# Altium project UZ_A_MAX11331.PrjPCB (part 3 of 3)
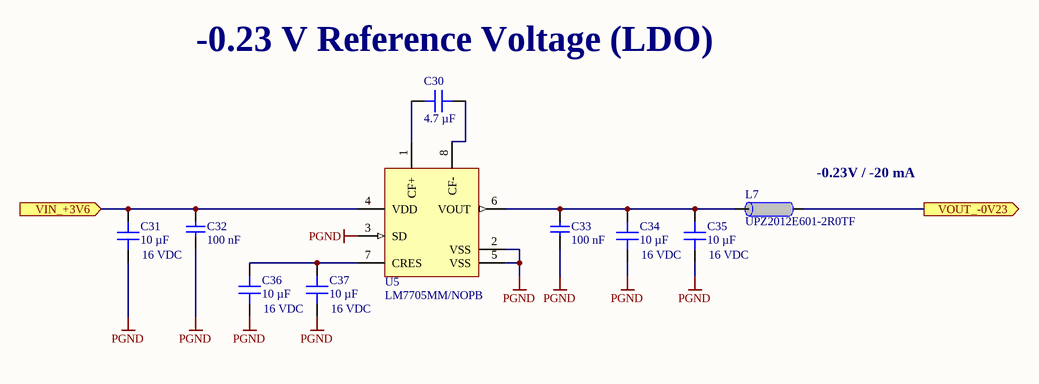
[diagram p12: Power_Supply_3.SchDoc]

## Nets that join several sheets
1V65_REF: AF1 (8 pins), AF2 (8 pins), AF3 (8 pins), AF4 (8 pins), AF5 (8 pins), AF6 (8 pins), Power_Supply_2 (C40.2 C41.2 TP11.1 U6.1)
3V3_REF: U_ADC_Signal_Distribution/ADC1 (C5A.2 C6A.2 U1A.18), U_ADC_Signal_Distribution/ADC2 (C5B.2 C6B.2 U1B.18), U_ADC_Signal_Distribution/ADC3 (C5C.2 C6C.2 U1C.18), Power_Supply_2 (C42.2 C43.2 TP10.1 U6.5)
+1V8: TopSheet (R3.2), Power_Supply_1 (C45.2 U7.2 U7.4), U_ADC_Signal_Distribution/ADC1 (C3A.2 C4A.2 U1A.26), U_ADC_Signal_Distribution/ADC2 (C3B.2 C4B.2 U1B.26), U_ADC_Signal_Distribution/ADC3 (C3C.2 C4C.2 U1C.26)
+3V6: TopSheet (R2.2), Power_Supply_1 (8 pins), Power_Supply_2 (L8.2), U_Power_Supply_2/Vneg_1 (C31A.2 C32A.2 U5A.4), U_Power_Supply_2/Vneg_2 (C31B.2 C32B.2 U5B.4), U_Power_Supply_2/Vneg_3 (C31C.2 C32C.2 U5C.4)
+3V6_A: AF1 (8 pins), U_ADC_Signal_Distribution/ADC1 (C1A.2 C2A.2 U1A.20 U1A.21), U_ADC_Signal_Distribution/ADC2 (C1B.2 C2B.2 U1B.20 U1B.21), U_ADC_Signal_Distribution/ADC3 (C1C.2 C2C.2 U1C.20 U1C.21), AF2 (8 pins), AF3 (8 pins), AF4 (8 pins), AF5 (8 pins), AF6 (8 pins), Power_Supply_2 (C74.2 C81.2 L5.1 TP9.1)
+5V2: AF1/BOA1 (C51A.1 R41A.2 R54A.2 U3A.8), AF1/BOA2 (C51B.1 R41B.2 R54B.2 U3B.8), AF1/BOA3 (C51C.1 R41C.2 R54C.2 U3C.8), AF1/BOA4 (C51D.1 R41D.2 R54D.2 U3D.8), AF2/BOA1 (C51E.1 R41E.2 R54E.2 U3E.8), AF2/BOA2 (C51F.1 R41F.2 R54F.2 U3F.8), AF2/BOA3 (C51G.1 R41G.2 R54G.2 U3G.8), AF2/BOA4 (C51H.1 R41H.2 R54H.2 U3H.8), AF3/BOA1 (C51I.1 R41I.2 R54I.2 U3I.8), AF3/BOA2 (C51J.1 R41J.2 R54J.2 U3J.8), AF3/BOA3 (C51K.1 R41K.2 R54K.2 U3K.8), AF3/BOA4 (C51L.1 R41L.2 R54L.2 U3L.8), AF4/BOA1 (C51M.1 R41M.2 R54M.2 U3M.8), AF4/BOA2 (C51N.1 R41N.2 R54N.2 U3N.8), AF4/BOA3 (C51O.1 R41O.2 R54O.2 U3O.8), AF4/BOA4 (C51P.1 R41P.2 R54P.2 U3P.8), AF5/BOA1 (C51Q.1 R41Q.2 R54Q.2 U3Q.8), AF5/BOA2 (C51R.1 R41R.2 R54R.2 U3R.8), AF5/BOA3 (C51S.1 R41S.2 R54S.2 U3S.8), AF5/BOA4 (C51T.1 R41T.2 R54T.2 U3T.8), AF6/BOA1 (C51U.1 R41U.2 R54U.2 U3U.8), AF6/BOA2 (C51V.1 R41V.2 R54V.2 U3V.8), AF6/BOA3 (C51W.1 R41W.2 R54W.2 U3W.8), AF6/BOA4 (C51X.1 R41X.2 R54X.2 U3X.8), Power_Supply_2 (C79.2 C80.2 L12.1 TP8.1)
+6V5: Power_Supply_1 (7 pins), Power_Supply_2 (L2.2 L11.2)
AGND: AnalogConnector (X5.1 X5.2 X5.3 X5.4), AF1 (12 pins), AF1/BOA1 (7 pins), AF1/BOA2 (7 pins), AF1/BOA3 (7 pins), AF1/BOA4 (7 pins), AF1/CDMF1 (C8A.1 C11A.2), AF1/CDMF2 (C8B.1 C11B.2), AF1/CDMF3 (C8C.1 C11C.2), AF1/CDMF4 (C8D.1 C11D.2), Power_Supply_1 (L6.1), U_ADC_Signal_Distribution/ADC1 (7 pins), U_ADC_Signal_Distribution/ADC2 (7 pins), U_ADC_Signal_Distribution/ADC3 (7 pins), AF2 (12 pins), AF2/BOA1 (7 pins), AF2/BOA2 (7 pins), AF2/BOA3 (7 pins), AF2/BOA4 (7 pins), AF2/CDMF1 (C8E.1 C11E.2), AF2/CDMF2 (C8F.1 C11F.2), AF2/CDMF3 (C8G.1 C11G.2), AF2/CDMF4 (C8H.1 C11H.2), AF3 (12 pins), AF3/BOA1 (7 pins), AF3/BOA2 (7 pins), AF3/BOA3 (7 pins), AF3/BOA4 (7 pins), AF3/CDMF1 (C8I.1 C11I.2), AF3/CDMF2 (C8J.1 C11J.2), AF3/CDMF3 (C8K.1 C11K.2), AF3/CDMF4 (C8L.1 C11L.2), AF4 (12 pins), AF4/BOA1 (7 pins), AF4/BOA2 (7 pins), AF4/BOA3 (7 pins), AF4/BOA4 (7 pins), AF4/CDMF1 (C8M.1 C11M.2), AF4/CDMF2 (C8N.1 C11N.2), AF4/CDMF3 (C8O.1 C11O.2), AF4/CDMF4 (C8P.1 C11P.2), AF5 (12 pins), AF5/BOA1 (7 pins), AF5/BOA2 (7 pins), AF5/BOA3 (7 pins), AF5/BOA4 (7 pins), AF5/CDMF1 (C8Q.1 C11Q.2), AF5/CDMF2 (C8R.1 C11R.2), AF5/CDMF3 (C8S.1 C11S.2), AF5/CDMF4 (C8T.1 C11T.2), AF6 (12 pins), AF6/BOA1 (7 pins), AF6/BOA2 (7 pins), AF6/BOA3 (7 pins), AF6/BOA4 (7 pins), AF6/CDMF1 (C8U.1 C11U.2), AF6/CDMF2 (C8V.1 C11V.2), AF6/CDMF3 (C8W.1 C11W.2), AF6/CDMF4 (C8X.1 C11X.2), Power_Supply_2 (25 pins)
GND: TopSheet (D1.1), CarrierConnector (41 pins), AnalogConnector (C46.2 R26.2), Power_Supply_1 (L3.1 L9.1 X4.2), U_ADC_Signal_Distribution/ADC1 (C3A.1 C4A.1 U1A.25), U_ADC_Signal_Distribution/ADC2 (C3B.1 C4B.1 U1B.25), U_ADC_Signal_Distribution/ADC3 (C3C.1 C4C.1 U1C.25)
PGND: TopSheet (D2.1 D3.1), Power_Supply_1 (30 pins), U_Power_Supply_2/Vneg_1 (10 pins), U_Power_Supply_2/Vneg_2 (10 pins), U_Power_Supply_2/Vneg_3 (10 pins)
VIN: TopSheet (R1.2), CarrierConnector (F1.2), Power_Supply_1 (L3.4 X4.1)
Vneg_1: AF1 (14 pins), AF1/BOA1 (C52A.2 U3A.4), AF1/BOA2 (C52B.2 U3B.4), AF1/BOA3 (C52C.2 U3C.4), AF1/BOA4 (C52D.2 U3D.4), AF2 (14 pins), AF2/BOA1 (C52E.2 U3E.4), AF2/BOA2 (C52F.2 U3F.4), AF2/BOA3 (C52G.2 U3G.4), AF2/BOA4 (C52H.2 U3H.4), U_Power_Supply_2/Vneg_1 (L7A.1)
Vneg_2: AF3 (14 pins), AF3/BOA1 (C52I.2 U3I.4), AF3/BOA2 (C52J.2 U3J.4), AF3/BOA3 (C52K.2 U3K.4), AF3/BOA4 (C52L.2 U3L.4), AF4 (14 pins), AF4/BOA1 (C52M.2 U3M.4), AF4/BOA2 (C52N.2 U3N.4), AF4/BOA3 (C52O.2 U3O.4), AF4/BOA4 (C52P.2 U3P.4), U_Power_Supply_2/Vneg_2 (L7B.1)
Vneg_3: AF5 (14 pins), AF5/BOA1 (C52Q.2 U3Q.4), AF5/BOA2 (C52R.2 U3R.4), AF5/BOA3 (C52S.2 U3S.4), AF5/BOA4 (C52T.2 U3T.4), AF6 (14 pins), AF6/BOA1 (C52U.2 U3U.4), AF6/BOA2 (C52V.2 U3V.4), AF6/BOA3 (C52W.2 U3W.4), AF6/BOA4 (C52X.2 U3X.4), U_Power_Supply_2/Vneg_3 (L7C.1)
ADC_CS1: CarrierConnector (X1.29), U_ADC_Signal_Distribution/ADC1 (R29A.2)
ADC_CS2: CarrierConnector (X1.23), U_ADC_Signal_Distribution/ADC2 (R29B.2)
ADC_CS3: CarrierConnector (X1.17), U_ADC_Signal_Distribution/ADC3 (R29C.2)
ADC_MISO1: CarrierConnector (X1.31), U_ADC_Signal_Distribution/ADC1 (R27A.2)
ADC_MISO2: CarrierConnector (X1.25), U_ADC_Signal_Distribution/ADC2 (R27B.2)
ADC_MISO3: CarrierConnector (X1.19), U_ADC_Signal_Distribution/ADC3 (R27C.2)
ADC_MOSI1: CarrierConnector (X1.32), U_ADC_Signal_Distribution/ADC1 (R28A.2)
ADC_MOSI2: CarrierConnector (X1.26), U_ADC_Signal_Distribution/ADC2 (R28B.2)
ADC_MOSI3: CarrierConnector (X1.20), U_ADC_Signal_Distribution/ADC3 (R28C.2)
ADC_SCLK1: CarrierConnector (X1.30), U_ADC_Signal_Distribution/ADC1 (R30A.2)
ADC_SCLK2: CarrierConnector (X1.24), U_ADC_Signal_Distribution/ADC2 (R30B.2)
ADC_SCLK3: CarrierConnector (X1.18), U_ADC_Signal_Distribution/ADC3 (R30C.2)
AIN_ADC_N1: AF1/CDMF1 (C8A.2 C10A.1 R16A.2 TP4A.1), U_ADC_Signal_Distribution/ADC1 (U1A.30)
AIN_ADC_N2: AF1/CDMF2 (C8B.2 C10B.1 R16B.2 TP4B.1), U_ADC_Signal_Distribution/ADC1 (U1A.32)
AIN_ADC_N3: AF1/CDMF3 (C8C.2 C10C.1 R16C.2 TP4C.1), U_ADC_Signal_Distribution/ADC1 (U1A.2)
AIN_ADC_N4: AF1/CDMF4 (C8D.2 C10D.1 R16D.2 TP4D.1), U_ADC_Signal_Distribution/ADC1 (U1A.4)
AIN_ADC_N5: U_ADC_Signal_Distribution/ADC1 (U1A.6), AF2/CDMF1 (C8E.2 C10E.1 R16E.2 TP4E.1)
AIN_ADC_N6: U_ADC_Signal_Distribution/ADC1 (U1A.8), AF2/CDMF2 (C8F.2 C10F.1 R16F.2 TP4F.1)
AIN_ADC_N7: U_ADC_Signal_Distribution/ADC1 (U1A.10), AF2/CDMF3 (C8G.2 C10G.1 R16G.2 TP4G.1)
AIN_ADC_N8: U_ADC_Signal_Distribution/ADC1 (U1A.16), AF2/CDMF4 (C8H.2 C10H.1 R16H.2 TP4H.1)
AIN_ADC_N9: U_ADC_Signal_Distribution/ADC2 (U1B.30), AF3/CDMF1 (C8I.2 C10I.1 R16I.2 TP4I.1)
AIN_ADC_N10: U_ADC_Signal_Distribution/ADC2 (U1B.32), AF3/CDMF2 (C8J.2 C10J.1 R16J.2 TP4J.1)
AIN_ADC_N11: U_ADC_Signal_Distribution/ADC2 (U1B.2), AF3/CDMF3 (C8K.2 C10K.1 R16K.2 TP4K.1)
AIN_ADC_N12: U_ADC_Signal_Distribution/ADC2 (U1B.4), AF3/CDMF4 (C8L.2 C10L.1 R16L.2 TP4L.1)
AIN_ADC_N13: U_ADC_Signal_Distribution/ADC2 (U1B.6), AF4/CDMF1 (C8M.2 C10M.1 R16M.2 TP4M.1)
AIN_ADC_N14: U_ADC_Signal_Distribution/ADC2 (U1B.8), AF4/CDMF2 (C8N.2 C10N.1 R16N.2 TP4N.1)
AIN_ADC_N15: U_ADC_Signal_Distribution/ADC2 (U1B.10), AF4/CDMF3 (C8O.2 C10O.1 R16O.2 TP4O.1)
AIN_ADC_N16: U_ADC_Signal_Distribution/ADC2 (U1B.16), AF4/CDMF4 (C8P.2 C10P.1 R16P.2 TP4P.1)
AIN_ADC_N17: U_ADC_Signal_Distribution/ADC3 (U1C.30), AF5/CDMF1 (C8Q.2 C10Q.1 R16Q.2 TP4Q.1)
AIN_ADC_N18: U_ADC_Signal_Distribution/ADC3 (U1C.32), AF5/CDMF2 (C8R.2 C10R.1 R16R.2 TP4R.1)
AIN_ADC_N19: U_ADC_Signal_Distribution/ADC3 (U1C.2), AF5/CDMF3 (C8S.2 C10S.1 R16S.2 TP4S.1)
AIN_ADC_N20: U_ADC_Signal_Distribution/ADC3 (U1C.4), AF5/CDMF4 (C8T.2 C10T.1 R16T.2 TP4T.1)
AIN_ADC_N21: U_ADC_Signal_Distribution/ADC3 (U1C.6), AF6/CDMF1 (C8U.2 C10U.1 R16U.2 TP4U.1)
AIN_ADC_N22: U_ADC_Signal_Distribution/ADC3 (U1C.8), AF6/CDMF2 (C8V.2 C10V.1 R16V.2 TP4V.1)
AIN_ADC_N23: U_ADC_Signal_Distribution/ADC3 (U1C.10), AF6/CDMF3 (C8W.2 C10W.1 R16W.2 TP4W.1)
AIN_ADC_N24: U_ADC_Signal_Distribution/ADC3 (U1C.16), AF6/CDMF4 (C8X.2 C10X.1 R16X.2 TP4X.1)
AIN_ADC_P1: AF1/CDMF1 (C10A.2 C11A.1 R18A.2 TP5A.1), U_ADC_Signal_Distribution/ADC1 (U1A.29)
AIN_ADC_P2: AF1/CDMF2 (C10B.2 C11B.1 R18B.2 TP5B.1), U_ADC_Signal_Distribution/ADC1 (U1A.31)
AIN_ADC_P3: AF1/CDMF3 (C10C.2 C11C.1 R18C.2 TP5C.1), U_ADC_Signal_Distribution/ADC1 (U1A.1)
AIN_ADC_P4: AF1/CDMF4 (C10D.2 C11D.1 R18D.2 TP5D.1), U_ADC_Signal_Distribution/ADC1 (U1A.3)
AIN_ADC_P5: U_ADC_Signal_Distribution/ADC1 (U1A.5), AF2/CDMF1 (C10E.2 C11E.1 R18E.2 TP5E.1)
AIN_ADC_P6: U_ADC_Signal_Distribution/ADC1 (U1A.7), AF2/CDMF2 (C10F.2 C11F.1 R18F.2 TP5F.1)
AIN_ADC_P7: U_ADC_Signal_Distribution/ADC1 (U1A.9), AF2/CDMF3 (C10G.2 C11G.1 R18G.2 TP5G.1)
AIN_ADC_P8: U_ADC_Signal_Distribution/ADC1 (U1A.15), AF2/CDMF4 (C10H.2 C11H.1 R18H.2 TP5H.1)
AIN_ADC_P9: U_ADC_Signal_Distribution/ADC2 (U1B.29), AF3/CDMF1 (C10I.2 C11I.1 R18I.2 TP5I.1)
AIN_ADC_P10: U_ADC_Signal_Distribution/ADC2 (U1B.31), AF3/CDMF2 (C10J.2 C11J.1 R18J.2 TP5J.1)
AIN_ADC_P11: U_ADC_Signal_Distribution/ADC2 (U1B.1), AF3/CDMF3 (C10K.2 C11K.1 R18K.2 TP5K.1)
AIN_ADC_P12: U_ADC_Signal_Distribution/ADC2 (U1B.3), AF3/CDMF4 (C10L.2 C11L.1 R18L.2 TP5L.1)
AIN_ADC_P13: U_ADC_Signal_Distribution/ADC2 (U1B.5), AF4/CDMF1 (C10M.2 C11M.1 R18M.2 TP5M.1)
AIN_ADC_P14: U_ADC_Signal_Distribution/ADC2 (U1B.7), AF4/CDMF2 (C10N.2 C11N.1 R18N.2 TP5N.1)
AIN_ADC_P15: U_ADC_Signal_Distribution/ADC2 (U1B.9), AF4/CDMF3 (C10O.2 C11O.1 R18O.2 TP5O.1)
AIN_ADC_P16: U_ADC_Signal_Distribution/ADC2 (U1B.15), AF4/CDMF4 (C10P.2 C11P.1 R18P.2 TP5P.1)
AIN_ADC_P17: U_ADC_Signal_Distribution/ADC3 (U1C.29), AF5/CDMF1 (C10Q.2 C11Q.1 R18Q.2 TP5Q.1)
AIN_ADC_P18: U_ADC_Signal_Distribution/ADC3 (U1C.31), AF5/CDMF2 (C10R.2 C11R.1 R18R.2 TP5R.1)
AIN_ADC_P19: U_ADC_Signal_Distribution/ADC3 (U1C.1), AF5/CDMF3 (C10S.2 C11S.1 R18S.2 TP5S.1)
AIN_ADC_P20: U_ADC_Signal_Distribution/ADC3 (U1C.3), AF5/CDMF4 (C10T.2 C11T.1 R18T.2 TP5T.1)
AIN_ADC_P21: U_ADC_Signal_Distribution/ADC3 (U1C.5), AF6/CDMF1 (C10U.2 C11U.1 R18U.2 TP5U.1)
AIN_ADC_P22: U_ADC_Signal_Distribution/ADC3 (U1C.7), AF6/CDMF2 (C10V.2 C11V.1 R18V.2 TP5V.1)
AIN_ADC_P23: U_ADC_Signal_Distribution/ADC3 (U1C.9), AF6/CDMF3 (C10W.2 C11W.1 R18W.2 TP5W.1)
AIN_ADC_P24: U_ADC_Signal_Distribution/ADC3 (U1C.15), AF6/CDMF4 (C10X.2 C11X.1 R18X.2 TP5X.1)
AIN_N1: AnalogConnector (X3.A2), AF1/BOA1 (D4A.2 R42A.2 R43A.1 R54A.1)
AIN_N2: AnalogConnector (X3.A6), AF1/BOA2 (D4B.2 R42B.2 R43B.1 R54B.1)
AIN_N3: AnalogConnector (X3.A5), AF1/BOA3 (D4C.2 R42C.2 R43C.1 R54C.1)
AIN_N4: AnalogConnector (X3.A8), AF1/BOA4 (D4D.2 R42D.2 R43D.1 R54D.1)
AIN_N5: AnalogConnector (X3.B2), AF2/BOA1 (D4E.2 R42E.2 R43E.1 R54E.1)
AIN_N6: AnalogConnector (X3.B6), AF2/BOA2 (D4F.2 R42F.2 R43F.1 R54F.1)
AIN_N7: AnalogConnector (X3.B5), AF2/BOA3 (D4G.2 R42G.2 R43G.1 R54G.1)
AIN_N8: AnalogConnector (X3.B8), AF2/BOA4 (D4H.2 R42H.2 R43H.1 R54H.1)
AIN_N9: AnalogConnector (X3.C2), AF3/BOA1 (D4I.2 R42I.2 R43I.1 R54I.1)
AIN_N10: AnalogConnector (X3.C6), AF3/BOA2 (D4J.2 R42J.2 R43J.1 R54J.1)
AIN_N11: AnalogConnector (X3.C5), AF3/BOA3 (D4K.2 R42K.2 R43K.1 R54K.1)
AIN_N12: AnalogConnector (X3.C8), AF3/BOA4 (D4L.2 R42L.2 R43L.1 R54L.1)
AIN_N13: AnalogConnector (X3.D2), AF4/BOA1 (D4M.2 R42M.2 R43M.1 R54M.1)
AIN_N14: AnalogConnector (X3.D6), AF4/BOA2 (D4N.2 R42N.2 R43N.1 R54N.1)
AIN_N15: AnalogConnector (X3.D5), AF4/BOA3 (D4O.2 R42O.2 R43O.1 R54O.1)
AIN_N16: AnalogConnector (X3.D8), AF4/BOA4 (D4P.2 R42P.2 R43P.1 R54P.1)
AIN_N17: AnalogConnector (X3.E2), AF5/BOA1 (D4Q.2 R42Q.2 R43Q.1 R54Q.1)
AIN_N18: AnalogConnector (X3.E6), AF5/BOA2 (D4R.2 R42R.2 R43R.1 R54R.1)
AIN_N19: AnalogConnector (X3.E5), AF5/BOA3 (D4S.2 R42S.2 R43S.1 R54S.1)
AIN_N20: AnalogConnector (X3.E8), AF5/BOA4 (D4T.2 R42T.2 R43T.1 R54T.1)
AIN_N21: AnalogConnector (X3.F2), AF6/BOA1 (D4U.2 R42U.2 R43U.1 R54U.1)
AIN_N22: AnalogConnector (X3.F6), AF6/BOA2 (D4V.2 R42V.2 R43V.1 R54V.1)
AIN_N23: AnalogConnector (X3.F5), AF6/BOA3 (D4W.2 R42W.2 R43W.1 R54W.1)
AIN_N24: AnalogConnector (X3.F8), AF6/BOA4 (D4X.2 R42X.2 R43X.1 R54X.1)
AIN_P1: AnalogConnector (X3.A1), AF1/BOA1 (D4A.1 R38A.1 R41A.1 R53A.2)
AIN_P2: AnalogConnector (X3.A3), AF1/BOA2 (D4B.1 R38B.1 R41B.1 R53B.2)
AIN_P3: AnalogConnector (X3.A4), AF1/BOA3 (D4C.1 R38C.1 R41C.1 R53C.2)
AIN_P4: AnalogConnector (X3.A7), AF1/BOA4 (D4D.1 R38D.1 R41D.1 R53D.2)
AIN_P5: AnalogConnector (X3.B1), AF2/BOA1 (D4E.1 R38E.1 R41E.1 R53E.2)
AIN_P6: AnalogConnector (X3.B3), AF2/BOA2 (D4F.1 R38F.1 R41F.1 R53F.2)
AIN_P7: AnalogConnector (X3.B4), AF2/BOA3 (D4G.1 R38G.1 R41G.1 R53G.2)
AIN_P8: AnalogConnector (X3.B7), AF2/BOA4 (D4H.1 R38H.1 R41H.1 R53H.2)
AIN_P9: AnalogConnector (X3.C1), AF3/BOA1 (D4I.1 R38I.1 R41I.1 R53I.2)
AIN_P10: AnalogConnector (X3.C3), AF3/BOA2 (D4J.1 R38J.1 R41J.1 R53J.2)
AIN_P11: AnalogConnector (X3.C4), AF3/BOA3 (D4K.1 R38K.1 R41K.1 R53K.2)
AIN_P12: AnalogConnector (X3.C7), AF3/BOA4 (D4L.1 R38L.1 R41L.1 R53L.2)
AIN_P13: AnalogConnector (X3.D1), AF4/BOA1 (D4M.1 R38M.1 R41M.1 R53M.2)
AIN_P14: AnalogConnector (X3.D3), AF4/BOA2 (D4N.1 R38N.1 R41N.1 R53N.2)
AIN_P15: AnalogConnector (X3.D4), AF4/BOA3 (D4O.1 R38O.1 R41O.1 R53O.2)
AIN_P16: AnalogConnector (X3.D7), AF4/BOA4 (D4P.1 R38P.1 R41P.1 R53P.2)
AIN_P17: AnalogConnector (X3.E1), AF5/BOA1 (D4Q.1 R38Q.1 R41Q.1 R53Q.2)
AIN_P18: AnalogConnector (X3.E3), AF5/BOA2 (D4R.1 R38R.1 R41R.1 R53R.2)
AIN_P19: AnalogConnector (X3.E4), AF5/BOA3 (D4S.1 R38S.1 R41S.1 R53S.2)
AIN_P20: AnalogConnector (X3.E7), AF5/BOA4 (D4T.1 R38T.1 R41T.1 R53T.2)
AIN_P21: AnalogConnector (X3.F1), AF6/BOA1 (D4U.1 R38U.1 R41U.1 R53U.2)
AIN_P22: AnalogConnector (X3.F3), AF6/BOA2 (D4V.1 R38V.1 R41V.1 R53V.2)
AIN_P23: AnalogConnector (X3.F4), AF6/BOA3 (D4W.1 R38W.1 R41W.1 R53W.2)
AIN_P24: AnalogConnector (X3.F7), AF6/BOA4 (D4X.1 R38X.1 R41X.1 R53X.2)
Buffer_N: AF1 (R13A.2), AF1/BOA1 (U3A.6 U3A.7)
Buffer_N: AF1 (R34A.2), AF1/BOA2 (U3B.6 U3B.7)
Buffer_N: AF1 (R14A.2), AF1/BOA3 (U3C.6 U3C.7)
Buffer_N: AF1 (R35A.2), AF1/BOA4 (U3D.6 U3D.7)
Buffer_N: AF2 (R13B.2), AF2/BOA1 (U3E.6 U3E.7)
Buffer_N: AF2 (R34B.2), AF2/BOA2 (U3F.6 U3F.7)
Buffer_N: AF2 (R14B.2), AF2/BOA3 (U3G.6 U3G.7)
Buffer_N: AF2 (R35B.2), AF2/BOA4 (U3H.6 U3H.7)
Buffer_N: AF3 (R13C.2), AF3/BOA1 (U3I.6 U3I.7)
Buffer_N: AF3 (R34C.2), AF3/BOA2 (U3J.6 U3J.7)
Buffer_N: AF3 (R14C.2), AF3/BOA3 (U3K.6 U3K.7)
Buffer_N: AF3 (R35C.2), AF3/BOA4 (U3L.6 U3L.7)
Buffer_N: AF4 (R13D.2), AF4/BOA1 (U3M.6 U3M.7)
Buffer_N: AF4 (R34D.2), AF4/BOA2 (U3N.6 U3N.7)
Buffer_N: AF4 (R14D.2), AF4/BOA3 (U3O.6 U3O.7)
Buffer_N: AF4 (R35D.2), AF4/BOA4 (U3P.6 U3P.7)
Buffer_N: AF5 (R13E.2), AF5/BOA1 (U3Q.6 U3Q.7)
Buffer_N: AF5 (R34E.2), AF5/BOA2 (U3R.6 U3R.7)
Buffer_N: AF5 (R14E.2), AF5/BOA3 (U3S.6 U3S.7)
Buffer_N: AF5 (R35E.2), AF5/BOA4 (U3T.6 U3T.7)
Buffer_N: AF6 (R13F.2), AF6/BOA1 (U3U.6 U3U.7)
Buffer_N: AF6 (R34F.2), AF6/BOA2 (U3V.6 U3V.7)
Buffer_N: AF6 (R14F.2), AF6/BOA3 (U3W.6 U3W.7)
Buffer_N: AF6 (R35F.2), AF6/BOA4 (U3X.6 U3X.7)
Buffer_P: AF1 (R11A.2), AF1/BOA1 (U3A.1 U3A.2)
Buffer_P: AF1 (R32A.2), AF1/BOA2 (U3B.1 U3B.2)
Buffer_P: AF1 (R12A.2), AF1/BOA3 (U3C.1 U3C.2)
Buffer_P: AF1 (R33A.2), AF1/BOA4 (U3D.1 U3D.2)
Buffer_P: AF2 (R11B.2), AF2/BOA1 (U3E.1 U3E.2)
Buffer_P: AF2 (R32B.2), AF2/BOA2 (U3F.1 U3F.2)
Buffer_P: AF2 (R12B.2), AF2/BOA3 (U3G.1 U3G.2)
Buffer_P: AF2 (R33B.2), AF2/BOA4 (U3H.1 U3H.2)
Buffer_P: AF3 (R11C.2), AF3/BOA1 (U3I.1 U3I.2)
Buffer_P: AF3 (R32C.2), AF3/BOA2 (U3J.1 U3J.2)
Buffer_P: AF3 (R12C.2), AF3/BOA3 (U3K.1 U3K.2)
Buffer_P: AF3 (R33C.2), AF3/BOA4 (U3L.1 U3L.2)
Buffer_P: AF4 (R11D.2), AF4/BOA1 (U3M.1 U3M.2)
Buffer_P: AF4 (R32D.2), AF4/BOA2 (U3N.1 U3N.2)
Buffer_P: AF4 (R12D.2), AF4/BOA3 (U3O.1 U3O.2)
Buffer_P: AF4 (R33D.2), AF4/BOA4 (U3P.1 U3P.2)
Buffer_P: AF5 (R11E.2), AF5/BOA1 (U3Q.1 U3Q.2)
Buffer_P: AF5 (R32E.2), AF5/BOA2 (U3R.1 U3R.2)
Buffer_P: AF5 (R12E.2), AF5/BOA3 (U3S.1 U3S.2)
Buffer_P: AF5 (R33E.2), AF5/BOA4 (U3T.1 U3T.2)
Buffer_P: AF6 (R11F.2), AF6/BOA1 (U3U.1 U3U.2)
Buffer_P: AF6 (R32F.2), AF6/BOA2 (U3V.1 U3V.2)
Buffer_P: AF6 (R12F.2), AF6/BOA3 (U3W.1 U3W.2)
Buffer_P: AF6 (R33F.2), AF6/BOA4 (U3X.1 U3X.2)
EOC1: CarrierConnector (X1.37), U_ADC_Signal_Distribution/ADC1 (R31A.2)
EOC2: CarrierConnector (X1.35), U_ADC_Signal_Distribution/ADC2 (R31B.2)
EOC3: CarrierConnector (X1.36), U_ADC_Signal_Distribution/ADC3 (R31C.2)
IN_N: AF1 (C7A.2 R9A.1 U2A.37), AF1/CDMF1 (R16A.1)
IN_N: AF1 (C14A.2 R19A.1 U2A.32), AF1/CDMF2 (R16B.1)
IN_N: AF1 (C9A.2 R10A.1 U2A.27), AF1/CDMF3 (R16C.1)
IN_N: AF1 (C15A.2 R20A.1 U2A.22), AF1/CDMF4 (R16D.1)
IN_N: AF2 (C7B.2 R9B.1 U2B.37), AF2/CDMF1 (R16E.1)
IN_N: AF2 (C14B.2 R19B.1 U2B.32), AF2/CDMF2 (R16F.1)
IN_N: AF2 (C9B.2 R10B.1 U2B.27), AF2/CDMF3 (R16G.1)
IN_N: AF2 (C15B.2 R20B.1 U2B.22), AF2/CDMF4 (R16H.1)
IN_N: AF3 (C7C.2 R9C.1 U2C.37), AF3/CDMF1 (R16I.1)
IN_N: AF3 (C14C.2 R19C.1 U2C.32), AF3/CDMF2 (R16J.1)
IN_N: AF3 (C9C.2 R10C.1 U2C.27), AF3/CDMF3 (R16K.1)
IN_N: AF3 (C15C.2 R20C.1 U2C.22), AF3/CDMF4 (R16L.1)
IN_N: AF4 (C7D.2 R9D.1 U2D.37), AF4/CDMF1 (R16M.1)
IN_N: AF4 (C14D.2 R19D.1 U2D.32), AF4/CDMF2 (R16N.1)
IN_N: AF4 (C9D.2 R10D.1 U2D.27), AF4/CDMF3 (R16O.1)
IN_N: AF4 (C15D.2 R20D.1 U2D.22), AF4/CDMF4 (R16P.1)
IN_N: AF5 (C7E.2 R9E.1 U2E.37), AF5/CDMF1 (R16Q.1)
IN_N: AF5 (C14E.2 R19E.1 U2E.32), AF5/CDMF2 (R16R.1)
IN_N: AF5 (C9E.2 R10E.1 U2E.27), AF5/CDMF3 (R16S.1)
IN_N: AF5 (C15E.2 R20E.1 U2E.22), AF5/CDMF4 (R16T.1)
IN_N: AF6 (C7F.2 R9F.1 U2F.37), AF6/CDMF1 (R16U.1)
IN_N: AF6 (C14F.2 R19F.1 U2F.32), AF6/CDMF2 (R16V.1)
IN_N: AF6 (C9F.2 R10F.1 U2F.27), AF6/CDMF3 (R16W.1)
IN_N: AF6 (C15F.2 R20F.1 U2F.22), AF6/CDMF4 (R16X.1)
IN_P: AF1 (C12A.2 R15A.1 U2A.36), AF1/CDMF1 (R18A.1)
IN_P: AF1 (C16A.2 R36A.1 U2A.31), AF1/CDMF2 (R18B.1)
IN_P: AF1 (C13A.2 R17A.1 U2A.26), AF1/CDMF3 (R18C.1)
IN_P: AF1 (C17A.2 R37A.1 U2A.21), AF1/CDMF4 (R18D.1)
IN_P: AF2 (C12B.2 R15B.1 U2B.36), AF2/CDMF1 (R18E.1)
IN_P: AF2 (C16B.2 R36B.1 U2B.31), AF2/CDMF2 (R18F.1)
IN_P: AF2 (C13B.2 R17B.1 U2B.26), AF2/CDMF3 (R18G.1)
IN_P: AF2 (C17B.2 R37B.1 U2B.21), AF2/CDMF4 (R18H.1)
IN_P: AF3 (C12C.2 R15C.1 U2C.36), AF3/CDMF1 (R18I.1)
IN_P: AF3 (C16C.2 R36C.1 U2C.31), AF3/CDMF2 (R18J.1)
IN_P: AF3 (C13C.2 R17C.1 U2C.26), AF3/CDMF3 (R18K.1)
IN_P: AF3 (C17C.2 R37C.1 U2C.21), AF3/CDMF4 (R18L.1)
IN_P: AF4 (C12D.2 R15D.1 U2D.36), AF4/CDMF1 (R18M.1)
IN_P: AF4 (C16D.2 R36D.1 U2D.31), AF4/CDMF2 (R18N.1)
IN_P: AF4 (C13D.2 R17D.1 U2D.26), AF4/CDMF3 (R18O.1)
IN_P: AF4 (C17D.2 R37D.1 U2D.21), AF4/CDMF4 (R18P.1)
IN_P: AF5 (C12E.2 R15E.1 U2E.36), AF5/CDMF1 (R18Q.1)
IN_P: AF5 (C16E.2 R36E.1 U2E.31), AF5/CDMF2 (R18R.1)
IN_P: AF5 (C13E.2 R17E.1 U2E.26), AF5/CDMF3 (R18S.1)
IN_P: AF5 (C17E.2 R37E.1 U2E.21), AF5/CDMF4 (R18T.1)
IN_P: AF6 (C12F.2 R15F.1 U2F.36), AF6/CDMF1 (R18U.1)
IN_P: AF6 (C16F.2 R36F.1 U2F.31), AF6/CDMF2 (R18V.1)
IN_P: AF6 (C13F.2 R17F.1 U2F.26), AF6/CDMF3 (R18W.1)
IN_P: AF6 (C17F.2 R37F.1 U2F.21), AF6/CDMF4 (R18X.1)

## Assembly variants
Differential_Input: not fitted C8A C8B C8C C8D C8E C8F C8G C8H C8I C8J C8K C8L C8M C8N C8O C8P C8Q C8R C8S C8T C8U C8V C8W C8X C11A C11B C11C C11D C11E C11F C11G C11H C11I C11J C11K C11L C11M C11N C11O C11P C11Q C11R C11S C11T C11U C11V C11W C11X H1 H2 H3 H4 R53A R53B R53C R53D R53E R53F R53G R53H R53I R53J R53K R53L R53M R53N R53O R53P R53Q R53R R53S R53T R53U R53V R53W R53X R54A R54B R54C R54D R54E R54F R54G R54H R54I R54J R54K R54L R54M R54N R54O R54P R54Q R54R R54S R54T R54U R54V R54W R54X X2 X4